# Altium schematic sheet Main.SchDoc
size A2; SheetNumber: 1; SheetTotal: 1
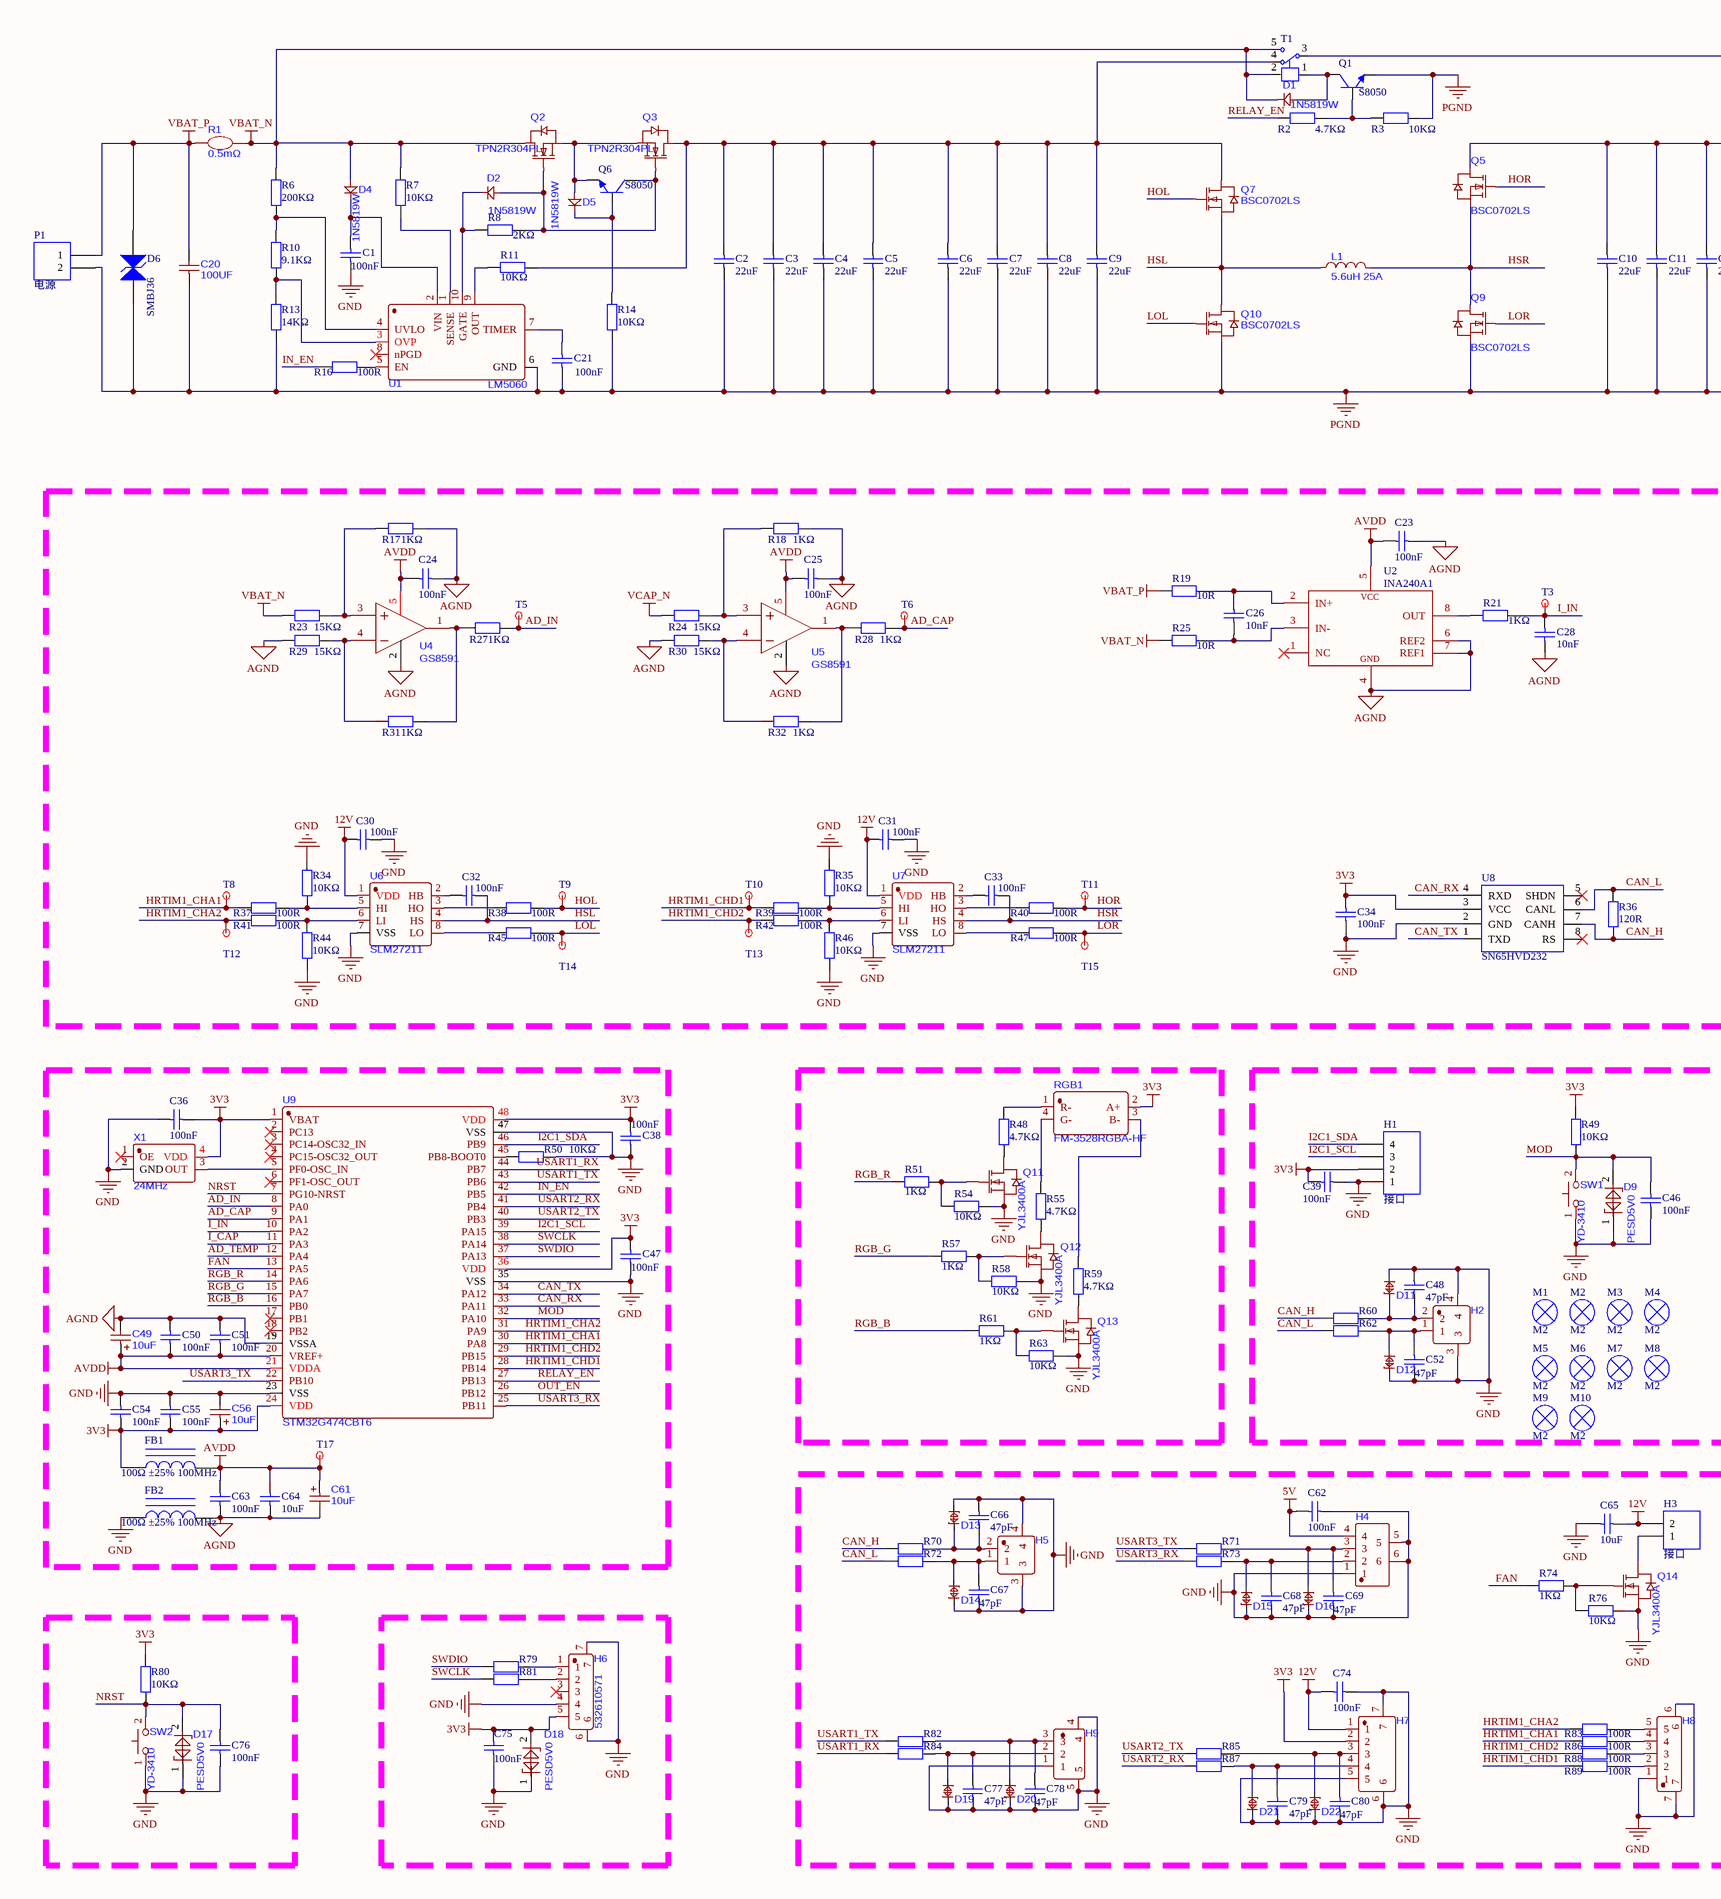
[diagram p0: Main.SchDoc, left]
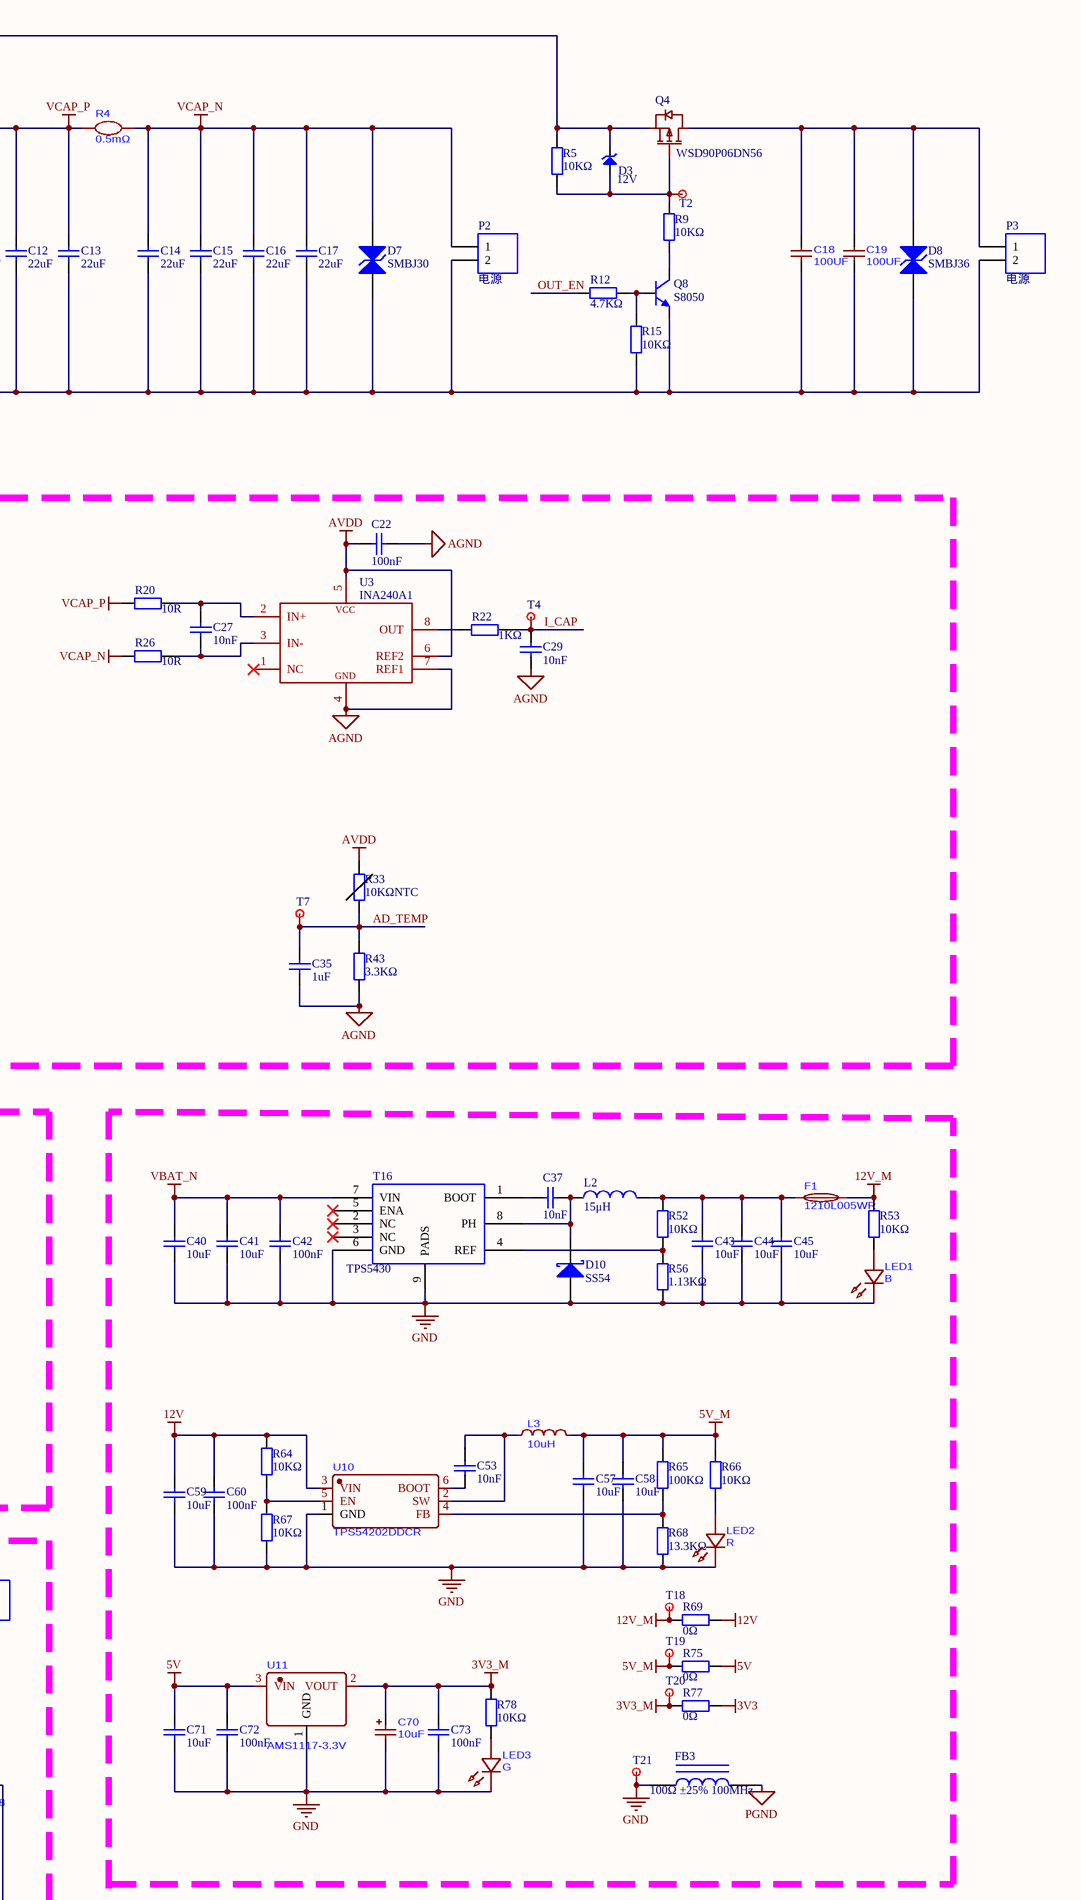
[diagram p1: Main.SchDoc, right]

## Parts
C1  100nF  [0402_C]
C2  22uF  [1206_C]
C3  22uF  [1206_C]
C4  22uF  [1206_C]
C5  22uF  [1206_C]
C6  22uF  [1206_C]
C7  22uF  [1206_C]
C8  22uF  [1206_C]
C9  22uF  [1206_C]
C10  22uF  [1206_C]
C11  22uF  [1206_C]
C12  22uF  [1206_C]
C13  22uF  [1206_C]
C14  22uF  [1206_C]
C15  22uF  [1206_C]
C16  22uF  [1206_C]
C17  22uF  [1206_C]
C18  100UF  [C1812]
C19  100UF  [C1812]
C20  100UF  [C1812]
C21  100nF  [0402_C]
C22  100nF  [0402_C]
C23  100nF  [0402_C]
C24  100nF  [0402_C]
C25  100nF  [0402_C]
C26  10nF  [0402_C]
C27  10nF  [0402_C]
C28  10nF  [0402_C]
C29  10nF  [0402_C]
C30  100nF  [0402_C]
C31  100nF  [0402_C]
C32  100nF  [0402_C]
C33  100nF  [0402_C]
C34  100nF  [0402_C]
C35  1uF  [0402_C]
C36  100nF  [0402_C]
C37  10nF  [0402_C]
C38  100nF  [0402_C]
C39  100nF  [0402_C]
C40  10uF  [1206_C]
C41  10uF  [1206_C]
C42  100nF  [0603_C]
C43  10uF  [1206_C]
C44  10uF  [1206_C]
C45  10uF  [1206_C]
C46  100nF  [0402_C]
C47  100nF  [0402_C]
C48  47pF  [0402_C]
C49  10uF  [CAP-SMD_L3.2-W1.6-RD-C7171]
C50  100nF  [0402_C]
C51  100nF  [0402_C]
C52  47pF  [0402_C]
C53  10nF  [0402_C]
C54  100nF  [0402_C]
C55  100nF  [0402_C]
C56  10uF  [CAP-SMD_L3.2-W1.6-RD-C7171]
C57  10uF  [1206_C]
C58  10uF  [1206_C]
C59  10uF  [1206_C]
C60  100nF  [0603_C]
C61  10uF  [CAP-SMD_L3.2-W1.6-RD-C7171]
C62  100nF  [0402_C]
C63  100nF  [0402_C]
C64  10uF  [0402_C]
C65  10uF  [1206_C]
C66  47pF  [0402_C]
C67  47pF  [0402_C]
C68  47pF  [0402_C]
C69  47pF  [0402_C]
C70  10uF  [CAP-SMD_L3.2-W1.6-RD-C7171]
C71  10uF  [0603_C]
C72  100nF  [0603_C]
C73  100nF  [0603_C]
C74  100nF  [0402_C]
C75  100nF  [0402_C]
C76  100nF  [0402_C]
C77  47pF  [0402_C]
C78  47pF  [0402_C]
C79  47pF  [0402_C]
C80  47pF  [0402_C]
D1  1N5819W  [SOD-123_L2.8-W1.8-LS3.7-RD]
D2  1N5819W  [SOD-123_L2.8-W1.8-LS3.7-RD]
D3  12V  [SOD-123]
D4  1N5819W  [SOD-123_L2.8-W1.8-LS3.7-RD]
D5  1N5819W  [SOD-123_L2.8-W1.8-LS3.7-RD]
D6  SMBJ36  [SMB(DO-214AA)_S1]
D7  SMBJ30  [SMB(DO-214AA)_S1]
D8  SMBJ36  [SMB(DO-214AA)_S1]
D9  PESD5V0  [SOD-882_L1.0-W0.6-BI]
D10  SS54  [SS54]
D11  PESD5V0F1BL,315  [SOD-882_L1.0-W0.6-BI]  (value not drawn)
D12  PESD5V0F1BL,315  [SOD-882_L1.0-W0.6-BI]  (value not drawn)
D13  PESD5V0F1BL,315  [SOD-882_L1.0-W0.6-BI]  (value not drawn)
D14  PESD5V0F1BL,315  [SOD-882_L1.0-W0.6-BI]  (value not drawn)
D15  PESD5V0F1BL,315  [SOD-882_L1.0-W0.6-BI]  (value not drawn)
D16  PESD5V0F1BL,315  [SOD-882_L1.0-W0.6-BI]  (value not drawn)
D17  PESD5V0  [SOD-882_L1.0-W0.6-BI]
D18  PESD5V0  [SOD-882_L1.0-W0.6-BI]
D19  PESD5V0F1BL,315  [SOD-882_L1.0-W0.6-BI]  (value not drawn)
D20  PESD5V0F1BL,315  [SOD-882_L1.0-W0.6-BI]  (value not drawn)
D21  PESD5V0F1BL,315  [SOD-882_L1.0-W0.6-BI]  (value not drawn)
D22  PESD5V0F1BL,315  [SOD-882_L1.0-W0.6-BI]  (value not drawn)
F1  1210L005WR  [F1210]
FB1  100Ω ±25% 100MHz  [0805_L]
FB2  100Ω ±25% 100MHz  [0805_L]
FB3  100Ω ±25% 100MHz  [0805_L]
H1  接口  [排母1X4]
H2  GH1.25-2PW  [CONN-TH_2P-P1.25_XUNPU_WAFER-GH1.25-2PLB]  (value not drawn)
H3  接口  [XH2.54-2P]
H4  53261-0471  [CONN-SMD_4P-P1.25_53261-0471]  (value not drawn)
H5  GH1.25-2PW  [CONN-TH_2P-P1.25_XUNPU_WAFER-GH1.25-2PLB]  (value not drawn)
H6  532610571  [CONN-SMD_5P-P1.25_532610571-2]
H7  GH1.25-5PW  [CONN-SMD_5P-P1.25_DEALON_L125WVS-05PW]  (value not drawn)
H8  532610571  [CONN-SMD_5P-P1.25_532610571-2]  (value not drawn)
H9  GH1.25-3PW  [CONN-SMD_GH1.25-3P]  (value not drawn)
L1  5.6uH 25A  [IND-SMD_L18.2-W18.2]
L2  15μH  [电感]
L3  10uH  [IND-SMD_L2.5-W2.0_WPN252012H]
LED1  B  [LED0402-RD]
LED2  R  [LED0402-RD]
LED3  G  [LED0402-RD]
M1  M2  [M2.5螺母]
M2  M2  [M2.5螺母]
M3  M2  [M2.5螺母]
M4  M2  [M2.5螺母]
M5  M2  [M2.5螺母]
M6  M2  [M2.5螺母]
M7  M2  [M2.5螺母]
M8  M2  [M2.5螺母]
M9  M2  [M2.5螺母]
M10  M2  [M2.5螺母]
P1  电源  [XT30PW-M]
P2  电源  [XT30PW-M]
P3  电源  [XT30PW-M]
Q1  S8050  [SOT-23]
Q2  TPN2R304PL  [TSON-8_L3.1-W3.1-P0.65-LS3.3-BL-EP]
Q3  TPN2R304PL  [TSON-8_L3.1-W3.1-P0.65-LS3.3-BL-EP]
Q4  WSD90P06DN56  [DFN-8_L5.8-W4.9-P1.27-LS6.0-BL-2]
Q5  BSC0702LS  [PG-TDSON-8_L5.0-W6.0-P1.27-BL-EP]
Q6  S8050  [SOT-23]
Q7  BSC0702LS  [PG-TDSON-8_L5.0-W6.0-P1.27-BL-EP]
Q8  S8050  [SOT-23]
Q9  BSC0702LS  [PG-TDSON-8_L5.0-W6.0-P1.27-BL-EP]
Q10  BSC0702LS  [PG-TDSON-8_L5.0-W6.0-P1.27-BL-EP]
Q11  YJL3400A  [SOT-23-3_L2.9-W1.3-P1.90-LS2.4-BR]
Q12  YJL3400A  [SOT-23-3_L2.9-W1.3-P1.90-LS2.4-BR]
Q13  YJL3400A  [SOT-23-3_L2.9-W1.3-P1.90-LS2.4-BR]
Q14  YJL3400A  [SOT-23-3_L2.9-W1.3-P1.90-LS2.4-BR]
R1  0.5mΩ  [RES-SMD_L6.4-W3.2_C500733]
R2  4.7KΩ  [0402_R]
R3  10KΩ  [0402_R]
R4  0.5mΩ  [RES-SMD_L6.4-W3.2_C500733]
R5  10KΩ  [0402_R]
R6  200KΩ  [0402_R]
R7  10KΩ  [0402_R]
R8  2KΩ  [0402_R]
R9  10KΩ  [0402_R]
R10  9.1KΩ  [0402_R]
R11  10KΩ  [0402_R]
R12  4.7KΩ  [0402_R]
R13  14KΩ  [0402_R]
R14  10KΩ  [0402_R]
R15  10KΩ  [0402_R]
R16  100R  [0402_R]
R17  1KΩ  [0402_R]
R18  1KΩ  [0402_R]
R19  10R  [0402_R]
R20  10R  [0402_R]
R21  1KΩ  [0402_R]
R22  1KΩ  [0402_R]
R23  15KΩ  [0402_R]
R24  15KΩ  [0402_R]
R25  10R  [0402_R]
R26  10R  [0402_R]
R27  1KΩ  [0402_R]
R28  1KΩ  [0402_R]
R29  15KΩ  [0402_R]
R30  15KΩ  [0402_R]
R31  1KΩ  [0402_R]
R32  1KΩ  [0402_R]
R33  10KΩNTC  [0402_R]
R34  10KΩ  [0402_R]
R35  10KΩ  [0402_R]
R36  120R  [0402_R]
R37  100R  [0402_R]
R38  100R  [0402_R]
R39  100R  [0402_R]
R40  100R  [0402_R]
R41  100R  [0402_R]
R42  100R  [0402_R]
R43  3.3KΩ  [0402_R]
R44  10KΩ  [0402_R]
R45  100R  [0402_R]
R46  10KΩ  [0402_R]
R47  100R  [0402_R]
R48  4.7KΩ  [0402_R]
R49  10KΩ  [0402_R]
R50  10KΩ  [0402_R]
R51  1KΩ  [0402_R]
R52  10KΩ  [0402_R]
R53  10KΩ  [0402_R]
R54  10KΩ  [0402_R]
R55  4.7KΩ  [0402_R]
R56  1.13KΩ  [0402_R]
R57  1KΩ  [0402_R]
R58  10KΩ  [0402_R]
R59  4.7KΩ  [0402_R]
R60  100Ω  [0402_R]  (value not drawn)
R61  1KΩ  [0402_R]
R62  100Ω  [0402_R]  (value not drawn)
R63  10KΩ  [0402_R]
R64  10KΩ  [0402_R]
R65  100KΩ  [0402_R]
R66  10KΩ  [0402_R]
R67  10KΩ  [0402_R]
R68  13.3KΩ  [0402_R]
R69  0Ω  [0603_R]
R70  100Ω  [0402_R]  (value not drawn)
R71  100Ω  [0402_R]  (value not drawn)
R72  100Ω  [0402_R]  (value not drawn)
R73  100Ω  [0402_R]  (value not drawn)
R74  1KΩ  [0402_R]
R75  0Ω  [0603_R]
R76  10KΩ  [0402_R]
R77  0Ω  [0603_R]
R78  10KΩ  [0402_R]
R79  100Ω  [0402_R]  (value not drawn)
R80  10KΩ  [0402_R]
R81  100Ω  [0402_R]  (value not drawn)
R82  100Ω  [0402_R]  (value not drawn)
R83  100R  [0402_R]
R84  100Ω  [0402_R]  (value not drawn)
R85  100Ω  [0402_R]  (value not drawn)
R86  100R  [0402_R]
R87  100Ω  [0402_R]  (value not drawn)
R88  100R  [0402_R]
R89  100R  [0402_R]
RGB1  FM-3528RGBA-HF  [LED-SMD_4P-L3.2-W2.8-LS3.5-BR-1]
SW1  YD-3410  [SW-SMD_L3.9-W2.9-LS4.8-EH-A]
SW2  YD-3410  [SW-SMD_L3.9-W2.9-LS4.8-EH-A]
T1  继电器  [SRD-24VDC-SL-C]  (value not drawn)
T2  testpoint  [testpoint]  (value not drawn)
T3  testpoint  [testpoint]  (value not drawn)
T4  testpoint  [testpoint]  (value not drawn)
T5  testpoint  [testpoint]  (value not drawn)
T6  testpoint  [testpoint]  (value not drawn)
T7  testpoint  [testpoint]  (value not drawn)
T8  testpoint  [testpoint]  (value not drawn)
T9  testpoint  [testpoint]  (value not drawn)
T10  testpoint  [testpoint]  (value not drawn)
T11  testpoint  [testpoint]  (value not drawn)
T12  testpoint  [testpoint]  (value not drawn)
T13  testpoint  [testpoint]  (value not drawn)
T14  testpoint  [testpoint]  (value not drawn)
T15  testpoint  [testpoint]  (value not drawn)
T16  TPS5430  [TPS5430DDAR]
T17  testpoint  [testpoint]  (value not drawn)
T18  testpoint  [testpoint]  (value not drawn)
T19  testpoint  [testpoint]  (value not drawn)
T20  testpoint  [testpoint]  (value not drawn)
T21  testpoint  [testpoint]  (value not drawn)
U1  LM5060  [VSSOP-10_L3.0-W3.0-P0.50-LS4.9-BL]
U2  INA240A1  [TSSOP8]
U3  INA240A1  [TSSOP8]
U4  GS8591  [SOT-23-5_L3.0-W1.7-P0.95-LS2.8-BR]
U5  GS8591  [SOT-23-5_L3.0-W1.7-P0.95-LS2.8-BR]
U6  SLM27211  [SOIC-8_L4.9-W3.9-P1.27-LS6.0-BL]
U7  SLM27211  [SOIC-8_L4.9-W3.9-P1.27-LS6.0-BL]
U8  SN65HVD232  [SOP8]
U9  STM32G474CBT6  [LQFP-48_L7.0-W7.0-P0.50-LS9.0-BL]
U10  TPS54202DDCR  [SOT-23-6_L2.9-W1.6-P0.95-LS2.8-BL]
U11  AMS1117-3.3V  [SOT-89-3_L4.5-W2.5-P1.50-LS4.2-BR]
X1  24MHz  [OSC-SMD_4P-L2.0-W1.6-BL_ABRACON_AMPMAXXX]

## Nets
3V3: C34.1 C36.2 C38.2 C39.1 C47.2 C54.1 C55.1 C56.1 C75.2 D18.2 FB1.1 H1.2 H6.5 H7.2 R49.1 R77.2 R80.1 RGB1.2(A+) U8.3(VCC) U9.1(VBAT) U9.24(VDD) U9.36(VDD) U9.48(VDD) X1.4(VDD)
3V3_M: C70.1 C73.2 R77.1 R78.2 T20.1(R) U11.2(VOUT)
5V: C62.2 C71.2 C72.2 H4.4 R75.2 U11.3(VIN)
5V_M: C57.2 C58.2 L3.2 R65.2 R66.2 R75.1 T19.1(R)
12V: C30.2 C31.2 C59.2 C60.2 C65.1 C74.2 H3.2 H7.1 R64.2 R69.2 U6.1(VDD) U7.1(VDD) U10.3(VIN)
12V_M: F1.2 R53.2 R69.1 T18.1(R)
AGND: C22.1 C23.1 C24.1 C25.1 C28.1 C29.1 C35.2 C49.2 C50.2 C51.2 C61.2 C63.1 C64.1 FB2.2 R17.1 R18.1 R29.2 R30.2 R43.2 U2.4(GND) U2.6(REF2) U2.7(REF1) U3.4(GND) U3.7(REF1) U4.2(V-) U5.2(V-) U9.19(VSSA)
AVDD: C22.2 C23.2 C24.2 C25.2 C49.1 C50.1 C51.1 C61.1 C63.2 C64.2 FB1.2 R33.1 T17.1(R) U2.5(VS) U3.5(VS) U3.6(REF2) U4.5(V+) U5.5(V+) U9.20(VREF+) U9.21(VDDA)
GND: C1.1 C30.1 C31.1 C34.2 C36.1 C38.1 C39.2 C40.1 C41.1 C42.1 C43.1 C44.1 C45.1 C46.1 C47.1 C48.1 C52.1 C54.2 C55.2 C56.2 C57.1 C58.1 C59.1 C60.1 C62.1 C65.2 C66.1 C67.1 C68.2 C69.1 C70.2 C71.1 C72.1 C73.1 C74.1 C75.1 C76.1 C77.2 C78.1 C79.2 C80.1 D9.1 D10.1(A) D11.2 D12.1 D13.2 D14.1 D15.1 D16.1 D17.1 D18.1 D19.1 D20.1 D21.1 D22.1 FB2.1 FB3.1 H1.1 H2.3 H2.4 H4.1 H4.5 H4.6 H5.3 H5.4 H6.4 H6.6 H6.7 H7.5 H7.6 H7.7 H8.1 H8.6 H8.7 H9.1 H9.4 H9.5 LED1.1(K) LED2.1(K) LED3.1(K) Q11.2(S) Q12.2(S) Q13.2(S) Q14.2(S) R34.1 R35.1 R44.2 R46.2 R50.1 R54.2 R56.1 R58.2 R63.2 R67.1 R68.1 R76.2 SW1.1 SW2.1 T16.6(GND) T16.9(PADS) T21.1(R) U6.7(VSS) U7.7(VSS) U8.2(GND) U9.23(VSS) U9.35(VSS) U9.47(VSS) U10.1(GND) U11.1(GND) X1.2(GND)
PGND: C2.1 C3.1 C4.1 C5.1 C6.1 C7.1 C8.1 C9.1 C10.1 C11.1 C12.1 C13.1 C14.1 C15.1 C16.1 C17.1 C18.1 C19.1 C20.1 C21.1 D6.1(A) D7.1(A) D8.1(A) FB3.2 P1.2 P2.2 P3.2 Q1.2(E) Q8.2(E) Q9.1(S) Q10.1(S) R3.1 R13.2 R14.1 R15.1 U1.6(GND)
VBAT_N: C40.2 C41.2 C42.2 D1.1(C) D4.2(A) Q2.3(D) R1.2 R6.1 R7.1 R23.2 R25.2 T1.2 T1.5 T16.7(VIN)
VBAT_P: C20.2 D6.2(K) P1.1 R1.1 R19.2
VCAP_N: C14.2 C15.2 C16.2 C17.2 D7.2(K) P2.1 R4.2 R24.2 R26.2
VCAP_P: C10.2 C11.2 C12.2 C13.2 Q5.3 R4.1 R20.2
AD_CAP: R28.1 T6.1(R) U9.9(PA1)
AD_IN: R27.1 T5.1(R) U9.8(PA0)
AD_TEMP: C35.1 R33.2 R43.1 T7.1(R) U9.12(PA4)
CAN_H: R36.2 R60.1 R70.1 U8.7(CANH)
CAN_L: R36.1 R62.1 R72.1 U8.6(CANL)
CAN_RX: U8.4(RXD) U9.33(PA11)
CAN_TX: U8.1(TXD) U9.34(PA12)
FAN: R74.1 U9.13(PA5)
HOL: Q7.2(G) R38.1 T9.1(R)
HOR: Q5.2(G) R40.1 T11.1(R)
HRTIM1_CHA1: R37.2 R86.2 T8.1(R) U9.30(PA8)
HRTIM1_CHA2: R41.2 R83.2 T12.1(R) U9.31(PA9)
HRTIM1_CHD1: R39.2 R89.2 T10.1(R) U9.28(PB14)
HRTIM1_CHD2: R42.2 R88.2 T13.1(R) U9.29(PB15)
HSL: C32.1 L1.1 Q7.1(S) Q10.3 U6.4(HS)
HSR: C33.1 L1.2 Q5.1(S) Q9.3 U7.4(HS)
I2C1_SCL: H1.3 U9.39(PA15)
I2C1_SDA: H1.4 U9.46(PB9)
I_CAP: C29.2 R22.1 T4.1(R) U9.11(PA3)
I_IN: C28.2 R21.1 T3.1(R) U9.10(PA2)
IN_EN: R16.2 U9.42(PB5)
LOL: Q10.2(G) R45.1 T14.1(R)
LOR: Q9.2(G) R47.1 T15.1(R)
MOD: C46.2 D9.2 R49.2 SW1.2 U9.32(PA10)
NRST: C76.2 D17.2 R80.2 SW2.2 U9.7(PG10-NRST)
OUT_EN: R12.2 U9.26(PB12)
RELAY_EN: R2.2 U9.27(PB13)
RGB_B: R61.1 U9.16(PB0)
RGB_G: R57.1 U9.15(PA7)
RGB_R: R51.1 U9.14(PA6)
SWCLK: R81.1 U9.38(PA14)
SWDIO: R79.1 U9.37(PA13)
USART1_RX: R84.1 U9.44(PB7)
USART1_TX: R82.1 U9.43(PB6)
USART2_RX: R87.1 U9.41(PB4)
USART2_TX: R85.1 U9.40(PB3)
USART3_RX: R73.1 U9.25(PB11)
USART3_TX: R71.1 U9.22(PB10)
NetC1_2: C1.2 D4.1(C) U1.2(VIN)
NetC2_2: C2.2 C3.2 C4.2 C5.2 C6.2 C7.2 C8.2 C9.2 Q3.3(D) Q7.3 R11.2 T1.4
NetC18_2: C18.2 C19.2 D8.2(K) P3.1 Q4.3(D)
NetC21_2: C21.2 U1.7(TIMER)
NetC26_1: C26.1 R25.1 U2.3(IN-)
NetC26_2: C26.2 R19.1 U2.2(IN+)
NetC27_1: C27.1 R26.1 U3.3(IN-)
NetC27_2: C27.2 R20.1 U3.2(IN+)
NetC32_2: C32.2 U6.2(HB)
NetC33_2: C33.2 U7.2(HB)
NetC37_1: C37.1 T16.1(BOOT)
NetC37_2: C37.2 D10.2(K) L2.1 T16.8(PH)
NetC43_2: C43.2 C44.2 C45.2 F1.1 L2.2 R52.2
NetC48_2: C48.2 D11.1 H2.2 R60.2
NetC52_2: C52.2 D12.2 H2.1 R62.2
NetC53_1: C53.1 U10.6(BOOT)
NetC53_2: C53.2 L3.1 U10.2(SW)
NetC66_2: C66.2 D13.1 H5.2 R70.2
NetC67_2: C67.2 D14.2 H5.1 R72.2
NetC68_1: C68.1 D15.2 H4.2 R73.2
NetC69_2: C69.2 D16.2 H4.3 R71.2
NetC77_1: C77.1 D19.2 H9.2 R84.2
NetC78_2: C78.2 D20.2 H9.3 R82.2
NetC79_1: C79.1 D21.2 H7.4 R87.2
NetC80_2: C80.2 D22.2 H7.3 R85.2
NetD1_2: D1.2(A) Q1.3(C) T1.1
NetD2_1: D2.1(C) R8.1 U1.10(GATE)
NetD2_2: D2.2(A) Q2.2(G) Q3.2(G) Q6.3(C) R8.2
NetD3_1: D3.1(A) Q4.2(G) R5.1 R9.2 T2.1(R)
NetD3_2: D3.2(K) Q4.1(S) R5.2 T1.3
NetD5_1: D5.1(C) Q6.1(B) R14.2
NetD5_2: D5.2(A) Q2.1(S) Q3.1(S) Q6.2(E)
NetH3_1: H3.1 Q14.3(D)
NetH6_1: H6.1 R79.2
NetH6_2: H6.2 R81.2
NetH8_2: H8.2 R89.1
NetH8_3: H8.3 R88.1
NetH8_4: H8.4 R86.1
NetH8_5: H8.5 R83.1
NetLED1_2: LED1.2(A) R53.1
NetLED2_2: LED2.2(A) R66.1
NetLED3_2: LED3.2(A) R78.1
NetQ1_1: Q1.1(B) R2.1 R3.2
NetQ8_1: Q8.1(B) R12.1 R15.2
NetQ8_3: Q8.3(C) R9.1
NetQ11_1: Q11.1(G) R51.2 R54.1
NetQ11_3: Q11.3(D) R48.1
NetQ12_1: Q12.1(G) R57.2 R58.1
NetQ12_3: Q12.3(D) R55.1
NetQ13_1: Q13.1(G) R61.2 R63.1
NetQ13_3: Q13.3(D) R59.1
NetQ14_1: Q14.1(G) R74.2 R76.1
NetR6_2: R6.2 R10.1 U1.4(UVLO)
NetR7_2: R7.2 U1.1(SENSE)
NetR10_2: R10.2 R13.1 U1.3(OVP)
NetR11_1: R11.1 U1.9(OUT)
NetR16_1: R16.1 U1.5(EN)
NetR17_2: R17.2 R23.1 U4.3(IN_A+)
NetR18_2: R18.2 R24.1 U5.3(IN_A+)
NetR21_2: R21.2 U2.8(OUT)
NetR22_2: R22.2 U3.8(OUT)
NetR27_2: R27.2 R31.1 U4.1(OUT_A)
NetR28_2: R28.2 R32.1 U5.1(OUT_A)
NetR29_1: R29.1 R31.2 U4.4(IN_A-)
NetR30_1: R30.1 R32.2 U5.4(IN_A-)
NetR34_2: R34.2 R37.1 U6.5(HI)
NetR35_2: R35.2 R39.1 U7.5(HI)
NetR38_2: R38.2 U6.3(HO)
NetR40_2: R40.2 U7.3(HO)
NetR41_1: R41.1 R44.1 U6.6(LI)
NetR42_1: R42.1 R46.1 U7.6(LI)
NetR45_2: R45.2 U6.8(LO)
NetR47_2: R47.2 U7.8(LO)
NetR48_2: R48.2 RGB1.1(R-)
NetR50_2: R50.2 U9.45(PB8-BOOT0)
NetR52_1: R52.1 R56.2 T16.4(REF)
NetR55_2: R55.2 RGB1.4(G-)
NetR59_2: R59.2 RGB1.3(B-)
NetR64_1: R64.1 R67.2 U10.5(EN)
NetR65_1: R65.1 R68.2 U10.4(FB)
NetU9_5: U9.5(PF0-OSC_IN) X1.3(OUT)

Not connected (* = marked no-connect by the designer): H6 3*; T16 2(NC)* 3(NC)* 5(ENA)*; U1 8(nPGD)*; U2 1(NC)*; U3 1(NC)*; U8 5(SHDN)* 8(RS)*; U9 2(PC13)* 3(PC14-OSC32_IN)* 4(PC15-OSC32_OUT)* 6(PF1-OSC_OUT)* 17(PB1)* 18(PB2)*; X1 1(OE)*

## Notes on the sheet
- (in symbol INA240Ax) VCC

## Library data of the parts
C1 C21-C34 C37 C53 = 0402 10nF (103) 10% 50V: 贴片电容; ComponentLink1Description: 供应商链接; ComponentLink1URL: http://www.szlcsc.com/product/details_15869.html; Package: 0402; Supplier: LC; SuppliersPartNumber: C15195
C2-C17 = 1206 100nF (104) 10% 50V: 贴片电容; ComponentLink1Description: 供应商链接; ComponentLink1URL: http://www.szlcsc.com/product/details_25237.html; Package: 1206; Supplier: LC; SuppliersPartNumber: C24497
C18-C20 = 100UF/50V-1812: 电容
C35 C36 C38 C39 C46 C47 C50 C51 C54 C55 C62-C64 C74-C76 = 0402 100nF (104) 10% 16V: 贴片电容; ComponentLink1Description: 供应商链接; ComponentLink1URL: http://www.szlcsc.com/product/details_1877.html; Package: 0402; Supplier: LC; SuppliersPartNumber: C1525
C40 C41 C43-C45 C57-C59 C65 = 1206 10uF (106) 10% 50V: 贴片电容; ComponentLink1Description: 供应商链接; ComponentLink1URL: http://www.szlcsc.com/product/details_14236.html; Package: 1206; Supplier: LC; SuppliersPartNumber: C13585
C42 C60 C71-C73 = 0603 100nF (104) 10% 50V: 贴片电容; ComponentLink1Description: 供应商链接; ComponentLink1URL: http://www.szlcsc.com/product/details_15331.html; Package: 0603; Supplier: LC; SuppliersPartNumber: C14663
C48 C52 C66-C69 C77-C80 = 0402 47pF (470) 5% 50V: 贴片电容; ComponentLink1Description: 供应商链接; ComponentLink1URL: http://www.szlcsc.com/product/details_1919.html; Package: 0402; Supplier: LC; SuppliersPartNumber: C1567
C49 C56 C61 C70 = 3216钽电容
D1 = 1N5819W: 二极管
D3 = 稳压二极管: ComponentLink1Description: 供应商链接; ComponentLink1URL: http://www.szlcsc.com/product/details_8541.html; Package: LL-34; Supplier: LC; SuppliersPartNumber: C8062
D6-D8 = SMB/DO-214AA P6SMB6.8CA: TVS; ComponentLink1Description: 供应商链接; ComponentLink1URL: http://www.szlcsc.com/product/details_79530.html; Package: SMB/DO-214AA; Supplier: LC; SuppliersPartNumber: C78395
D9 D17 D18 = PESD5V0F1BL,315
D10 = SS54: Schottky Diode; Published: 8-Jun-2000; LatestRevisionDate: 17-Jul-2002; LatestRevisionNote: Re-released for DXP Platform.; PackageReference: SMB; Publisher: Altium Limited; PackageDescription: DO-214-AA/SMB; 2 C-Bend Leads; Body 5.3 x 3.6 mm, inc. leads (LxW); Code_JEDEC: DO-214-AA
FB1-FB3 = 0805 100Ω 25% 100MHz: 贴片磁珠; ComponentLink1Description: 供应商链接; ComponentLink1URL: http://www.szlcsc.com/product/details_1367.html; Package: 0805; Supplier: LC; SuppliersPartNumber: C1015
H1 = 排母1X4: Header, 4-Pin; LatestRevisionDate: 17-Jul-2002; LatestRevisionNote: Re-released for DXP Platform.; Publisher: Altium Limited
H3 = XH2.54 2P: Header, 2-Pin; LatestRevisionDate: 17-Jul-2002; LatestRevisionNote: Re-released for DXP Platform.; Publisher: Altium Limited
L1 = 功率电感
L2 = 15μH: 贴片电感; Code_IEC: 1005; Published: 8-Jun-2000; LatestRevisionDate: 29-May-2009; LatestRevisionNote: IPC-7351 Footprint Added.; PackageReference: 0402-A; Publisher: Altium Limited; PackageDescription: Chip Inductor; Code_JEITA: 0402
L3 = 10uH 1.1A
LED1-LED3 = TJ-S1005CL4T5ALC3DW-A5
M1-M10 = M2螺母: M2焊接螺母
P1-P3 = XT30公头卧式: Header, 2-Pin; LatestRevisionDate: 17-Jul-2002; LatestRevisionNote: Re-released for DXP Platform.; Publisher: Altium Limited
Q1 Q6 Q8 = NPN三极管: 三极管; ComponentLink1Description: 供应商链接; ComponentLink1URL: http://www.szlcsc.com/product/details_2507.html; Package: SOT-23; Supplier: LC; SuppliersPartNumber: C2150
Q4 = WSD90P06DN56: PMOS
R1 R4 = 2512: 2512采样电阻
R2 R3 R5-R55 R57-R68 R70-R74 R76 R78-R89 = 0402 10KΩ (1002) 1%: 贴片电阻; ComponentLink1Description: 供应商链接; ComponentLink1URL: http://www.szlcsc.com/product/details_26487.html; Package: 0402; Supplier: LC; SuppliersPartNumber: C25744
R56 = 0402 3.3KΩ (3301) 1%: 贴片电阻; ComponentLink1Description: 供应商链接; ComponentLink1URL: http://www.szlcsc.com/product/details_26633.html; Package: 0402; Supplier: LC; SuppliersPartNumber: C25890
R69 R75 R77 = 0603 0Ω (0R0) 1%: 贴片电阻; ComponentLink1Description: 供应商链接; ComponentLink1URL: http://www.szlcsc.com/product/details_21903.html; Package: 0603; Supplier: LC; SuppliersPartNumber: C21189
T1 = SRD-24VDC-SL-C: 5脚继电器; Published: 24-Mar-1999; LatestRevisionDate: 17-Jul-2002; LatestRevisionNote: Re-released for DXP Platform.; PackageReference: MODULE5B; Publisher: Altium Limited
T2-T15 T17-T21 = testpoint: 测试点
T16 = TPS5430: 24V-5V
U2 U3 = INA240Ax: 电流放大器; 厂家: TI
U8 = SN65HVD232: CAN芯片
U11 = AMS1117-3.3VSOT-89
X1 = AMPMAFC-25.0000T